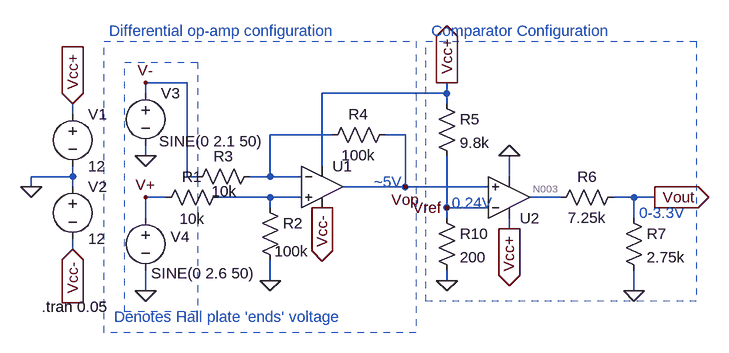
[diagram p0: schematic opAmp.asc]
opAmp.asc, the LTspice schematic file:
Version 4
SHEET 1 1904 680
WIRE 640 -48 576 -48
WIRE 576 -32 576 -48
WIRE 1040 -32 1040 -48
WIRE 1040 -32 848 -32
WIRE 1040 -16 1040 -32
WIRE 464 0 464 -16
WIRE 864 32 768 32
WIRE 976 32 944 32
WIRE 576 64 576 48
WIRE 848 80 848 -32
WIRE 464 96 464 80
WIRE 464 96 400 96
WIRE 640 96 640 -48
WIRE 656 96 640 96
WIRE 768 96 768 32
WIRE 768 96 736 96
WIRE 816 96 768 96
WIRE 1136 96 1136 64
WIRE 400 112 400 96
WIRE 464 112 464 96
WIRE 976 112 976 32
WIRE 976 112 880 112
WIRE 1104 112 976 112
WIRE 608 128 576 128
WIRE 768 128 688 128
WIRE 816 128 768 128
WIRE 1216 128 1168 128
WIRE 1328 128 1296 128
WIRE 1360 128 1328 128
WIRE 768 144 768 128
WIRE 1040 144 1040 64
WIRE 1104 144 1040 144
WIRE 576 160 576 128
WIRE 1040 160 1040 144
WIRE 1328 160 1328 128
WIRE 1136 176 1136 160
WIRE 464 208 464 192
WIRE 768 256 768 224
WIRE 1040 256 1040 240
WIRE 576 272 576 240
WIRE 1328 272 1328 240
FLAG 400 112 0
FLAG 464 -16 Vcc+
IOPIN 464 -16 In
FLAG 464 208 Vcc-
IOPIN 464 208 In
FLAG 848 144 Vcc-
IOPIN 848 144 Out
FLAG 768 256 0
FLAG 576 64 0
FLAG 576 272 0
FLAG 1328 272 0
FLAG 1040 -48 Vcc+
IOPIN 1040 -48 Out
FLAG 1040 256 0
FLAG 1360 128 Vout
IOPIN 1360 128 Out
FLAG 576 -48 V-
FLAG 576 128 V+
FLAG 976 112 Vop
FLAG 1040 144 Vref
FLAG 1136 176 Vcc+
IOPIN 1136 176 Out
FLAG 1136 64 0
SYMBOL voltage 464 -16 R0
SYMATTR InstName V1
SYMATTR Value 12
SYMBOL voltage 464 96 R0
SYMATTR InstName V2
SYMATTR Value 12
SYMBOL Opamps\\UniversalOpamp2 848 112 R0
SYMATTR InstName U1
SYMBOL res 960 16 R90
WINDOW 0 0 56 VBottom 2
WINDOW 3 32 56 VTop 2
SYMATTR InstName R4
SYMATTR Value 100k
SYMBOL res 752 80 R90
WINDOW 0 0 56 VBottom 2
WINDOW 3 23 55 VTop 2
SYMATTR InstName R3
SYMATTR Value 10k
SYMBOL res 752 128 R0
WINDOW 3 23 83 Left 2
SYMATTR InstName R2
SYMATTR Value 100k
SYMBOL res 704 112 R90
WINDOW 0 0 56 VBottom 2
WINDOW 3 33 56 VTop 2
SYMATTR InstName R1
SYMATTR Value 10k
SYMBOL voltage 576 144 R0
WINDOW 0 39 45 Left 2
WINDOW 3 9 101 Left 2
WINDOW 123 0 0 Left 0
WINDOW 39 0 0 Left 0
SYMATTR InstName V4
SYMATTR Value SINE(0 2.6 50)
SYMBOL voltage 576 -48 R0
WINDOW 3 21 90 Left 2
WINDOW 123 0 0 Left 0
WINDOW 39 0 0 Left 0
SYMATTR InstName V3
SYMATTR Value SINE(0 2.1 50)
SYMBOL Opamps\\UniversalOpamp2 1136 128 M180
SYMATTR InstName U2
SYMBOL res 1312 112 R90
WINDOW 0 0 56 VBottom 2
WINDOW 3 32 56 VTop 2
SYMATTR InstName R6
SYMATTR Value 7.25k
SYMBOL res 1312 144 R0
SYMATTR InstName R7
SYMATTR Value 2.75k
SYMBOL res 1024 -32 R0
SYMATTR InstName R5
SYMATTR Value 9.8k
SYMBOL res 1024 144 R0
SYMATTR InstName R10
SYMATTR Value 200
TEXT 416 296 Left 2 !.tran 0.05
TEXT 1336 152 Left 2 ;0-3.3V
TEXT 528 312 Left 2 ;Denotes Hall plate 'ends' voltage
TEXT 928 104 Left 2 ;~5V
TEXT 1048 136 Left 2 ;0.24V
TEXT 520 -128 Left 2 ;Differential op-amp configuration
TEXT 1016 -128 Left 2 ;Comparator Configuration
RECTANGLE Normal 656 304 544 -80 3
RECTANGLE Normal 992 336 512 -112 1
RECTANGLE Normal 1424 288 1008 -112 1

The netlist it stands for:
* opAmp.asc
V1 Vcc+ 0 12
V2 0 Vcc- 12
XU1 N002 N001 Vcc+ Vcc- Vop level.2 Avol=1Meg GBW=10Meg Slew=10Meg ilimit=25m rail=0 Vos=0 phimargin=45 en=0 enk=0 in=0 ink=0 Rin=500Meg  ; pins IN+ IN- V+ V- OUT
R4 Vop N001 100k
R3 N001 V- 10k
R2 N002 0 100k
R1 N002 V+ 10k
V4 V+ 0 SINE(0 2.6 50)
V3 V- 0 SINE(0 2.1 50)
XU2 Vop Vref Vcc+ 0 N003 level.2 Avol=1Meg GBW=10Meg Slew=10Meg ilimit=25m rail=0 Vos=0 phimargin=45 en=0 enk=0 in=0 ink=0 Rin=500Meg  ; pins IN+ IN- V+ V- OUT
R6 Vout N003 7.25k
R7 Vout 0 2.75k
R5 Vcc+ Vref 9.8k
R10 Vref 0 200
.tran 0.05
* 0-3.3V
* Denotes Hall plate 'ends' voltage
* ~5V
* 0.24V
* Differential op-amp configuration
* Comparator Configuration
.lib UniversalOpamps2.sub
.backanno
.end

* Results of the author's LTspice run, read from the files saved beside the schematic
* Operating Point, zero values left out:
*   V(vcc+) = 12 V
*   V(vcc-) = -12 V
*   V(n003) = 14.55 µV
*   V(vref) = 240 mV
*   V(vout) = 4.002 µV
*   I(R10) = 1.2 mA
*   I(R5) = 1.2 mA
*   I(R7) = 1.455 nA
*   I(R6) = -1.455 nA
*   I(V2) = -1.199 mA
*   I(V1) = -2.401 mA
*   Ix(u1:3) = 1.199 mA
*   Ix(u1:4) = -1.199 mA
*   Ix(u1:5) = 12 nA
*   Ix(u2:1) = -12 nA
*   Ix(u2:2) = -11.52 nA
*   Ix(u2:3) = 1.429 µA
*   Ix(u2:4) = -1.298 µA
*   Ix(u2:5) = -1.455 nA
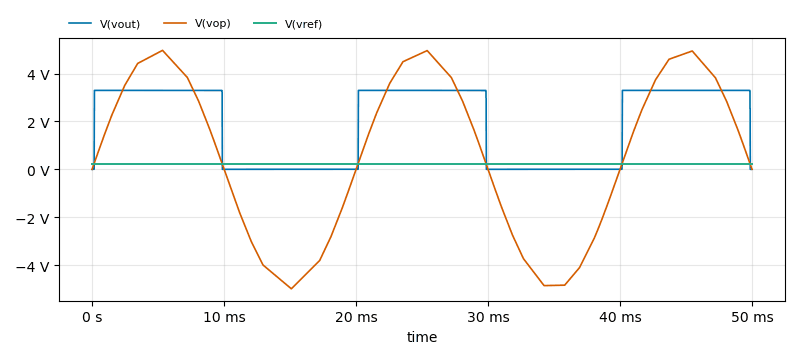
[diagram p1: Transient Analysis of opAmp.asc, plotted from the saved traces]
* Transient Analysis, 1 run:
*   V(vout): min 3.929 µV, max 3.296 V, average 1.917 V, rms 2.513 V, last 4.134 µV
*   V(vop): min -4.991 V, max 4.968 V, average 627.5 mV, rms 3.481 V, last 275.5 µV
*   V(vref): min 240 mV, max 240 mV, average 240 mV, rms 240 mV, last 240 mV